# Altium project steve.PrjPcb (part 2 of 3)

## Sheet button_io.SchDoc
size A4
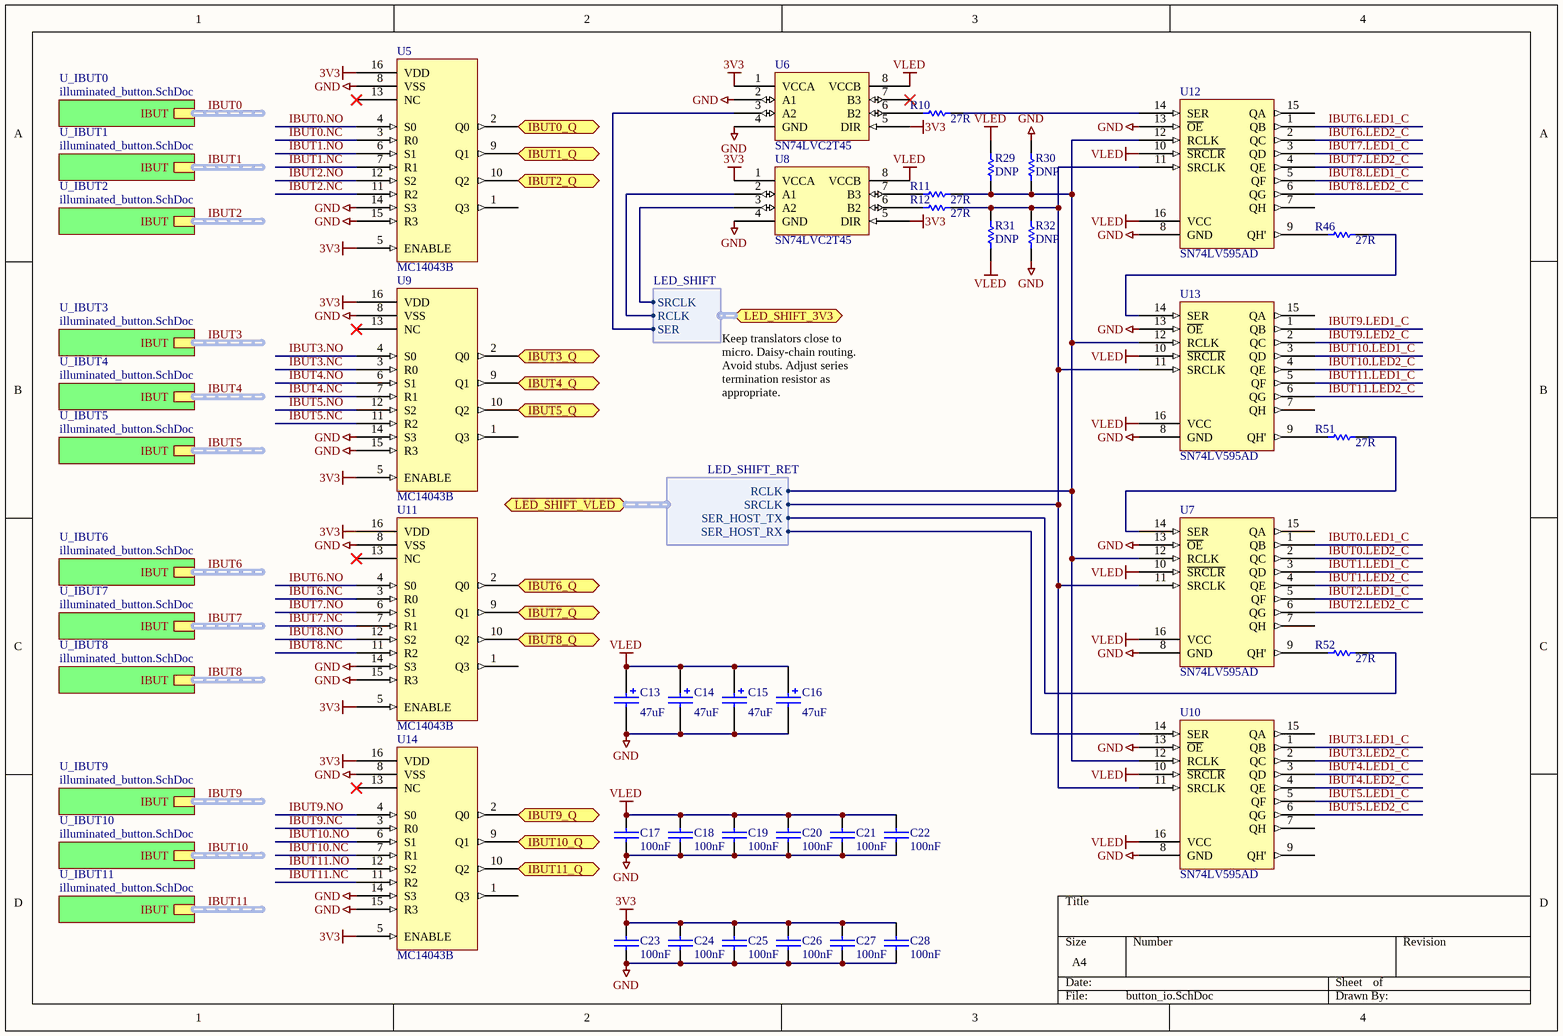
[diagram p6: button_io.SchDoc]

### Parts
C13  value 47uF  [CAPMP7343X19N (Murata D4)]
C14  value 47uF  [CAPMP7343X19N (Murata D4)]
C15  value 47uF  [CAPMP7343X19N (Murata D4)]
C16  value 47uF  [CAPMP7343X19N (Murata D4)]
C17  100nF  [0603]
C18  100nF  [0603]
C19  100nF  [0603]
C20  100nF  [0603]
C21  100nF  [0603]
C22  100nF  [0603]
C23  100nF  [0603]
C24  100nF  [0603]
C25  100nF  [0603]
C26  100nF  [0603]
C27  100nF  [0603]
C28  100nF  [0603]
R10  27R  [0603]
R11  27R  [0603]
R12  27R  [0603]
R29  DNP  [0603]
R30  DNP  [0603]
R31  DNP  [0603]
R32  DNP  [0603]
R46  27R  [0603]
R51  27R  [0603]
R52  27R  [0603]
U5  MC14043B  [SOIC127P600X175-16N]
U6  SN74LVC2T45  [TSOP65P400X130-8N]
U7  SN74LV595AD  [SOIC127P600X175-16N]
U8  SN74LVC2T45  [TSOP65P400X130-8N]
U9  MC14043B  [SOIC127P600X175-16N]
U10  SN74LV595AD  [SOIC127P600X175-16N]
U11  MC14043B  [SOIC127P600X175-16N]
U12  SN74LV595AD  [SOIC127P600X175-16N]
U13  SN74LV595AD  [SOIC127P600X175-16N]
U14  MC14043B  [SOIC127P600X175-16N]

### Sub-sheets
U_IBUT0 = illuminated_button.SchDoc: IBUT (harness IBUT)
U_IBUT1 = illuminated_button.SchDoc: IBUT (harness IBUT)
U_IBUT2 = illuminated_button.SchDoc: IBUT (harness IBUT)
U_IBUT3 = illuminated_button.SchDoc: IBUT (harness IBUT)
U_IBUT4 = illuminated_button.SchDoc: IBUT (harness IBUT)
U_IBUT5 = illuminated_button.SchDoc: IBUT (harness IBUT)
U_IBUT6 = illuminated_button.SchDoc: IBUT (harness IBUT)
U_IBUT7 = illuminated_button.SchDoc: IBUT (harness IBUT)
U_IBUT8 = illuminated_button.SchDoc: IBUT (harness IBUT)
U_IBUT9 = illuminated_button.SchDoc: IBUT (harness IBUT)
U_IBUT10 = illuminated_button.SchDoc: IBUT (harness IBUT)
U_IBUT11 = illuminated_button.SchDoc: IBUT (harness IBUT)

### Ports
IBUT0_Q (out), IBUT1_Q (out), IBUT2_Q (out), IBUT3_Q (out), IBUT4_Q (out), IBUT5_Q (out), IBUT6_Q (out), IBUT7_Q (out), IBUT8_Q (out), IBUT9_Q (out), IBUT10_Q (out), IBUT11_Q (out), LED_SHIFT_3V3 (harness LED_SHIFT), LED_SHIFT_VLED (harness LED_SHIFT_RET)

### Harnesses
LED_SHIFT: SER, RCLK, SRCLK
LED_SHIFT_RET: SER_HOST_TX, RCLK, SRCLK, SER_HOST_RX

### Nets
3V3: C23.1 C24.1 C25.1 C26.1 C27.1 C28.1 U5.5(ENABLE) U5.16(VDD) U6.1(VCCA) U6.5(DIR) U8.1(VCCA) U8.5(DIR) U9.5(ENABLE) U9.16(VDD) U11.5(ENABLE) U11.16(VDD) U14.5(ENABLE) U14.16(VDD)
GND: C13.2 C14.2 C15.2 C16.2 C17.2 C18.2 C19.2 C20.2 C21.2 C22.2 C23.2 C24.2 C25.2 C26.2 C27.2 C28.2 R30.1 R32.2 U5.8(VSS) U5.14(S3) U5.15(R3) U6.2(A1) U6.4(GND) U7.8(GND) U7.13(~{OE}) U8.4(GND) U9.8(VSS) U9.14(S3) U9.15(R3) U10.8(GND) U10.13(~{OE}) U11.8(VSS) U11.14(S3) U11.15(R3) U12.8(GND) U12.13(~{OE}) U13.8(GND) U13.13(~{OE}) U14.8(VSS) U14.14(S3) U14.15(R3)
VLED: C13.1 C14.1 C15.1 C16.1 C17.1 C18.1 C19.1 C20.1 C21.1 C22.1 R29.1 R31.2 U6.8(VCCB) U7.10(~{SRCLR}) U7.16(VCC) U8.8(VCCB) U10.10(~{SRCLR}) U10.16(VCC) U12.10(~{SRCLR}) U12.16(VCC) U13.10(~{SRCLR}) U13.16(VCC)
IBUT0.LED1_C: U7.1(QB)
IBUT0.LED2_C: U7.2(QC)
IBUT0.NC: U5.3(R0)
IBUT0.NO: U5.4(S0)
IBUT1.LED1_C: U7.3(QD)
IBUT1.LED2_C: U7.4(QE)
IBUT1.NC: U5.7(R1)
IBUT1.NO: U5.6(S1)
IBUT2.LED1_C: U7.5(QF)
IBUT2.LED2_C: U7.6(QG)
IBUT2.NC: U5.11(R2)
IBUT2.NO: U5.12(S2)
IBUT3.LED1_C: U10.1(QB)
IBUT3.LED2_C: U10.2(QC)
IBUT3.NC: U9.3(R0)
IBUT3.NO: U9.4(S0)
IBUT4.LED1_C: U10.3(QD)
IBUT4.LED2_C: U10.4(QE)
IBUT4.NC: U9.7(R1)
IBUT4.NO: U9.6(S1)
IBUT5.LED1_C: U10.5(QF)
IBUT5.LED2_C: U10.6(QG)
IBUT5.NC: U9.11(R2)
IBUT5.NO: U9.12(S2)
IBUT6.LED1_C: U12.1(QB)
IBUT6.LED2_C: U12.2(QC)
IBUT6.NC: U11.3(R0)
IBUT6.NO: U11.4(S0)
IBUT7.LED1_C: U12.3(QD)
IBUT7.LED2_C: U12.4(QE)
IBUT7.NC: U11.7(R1)
IBUT7.NO: U11.6(S1)
IBUT8.LED1_C: U12.5(QF)
IBUT8.LED2_C: U12.6(QG)
IBUT8.NC: U11.11(R2)
IBUT8.NO: U11.12(S2)
IBUT9.LED1_C: U13.1(QB)
IBUT9.LED2_C: U13.2(QC)
IBUT9.NC: U14.3(R0)
IBUT9.NO: U14.4(S0)
IBUT10.LED1_C: U13.3(QD)
IBUT10.LED2_C: U13.4(QE)
IBUT10.NC: U14.7(R1)
IBUT10.NO: U14.6(S1)
IBUT11.LED1_C: U13.5(QF)
IBUT11.LED2_C: U13.6(QG)
IBUT11.NC: U14.11(R2)
IBUT11.NO: U14.12(S2)
PIO 0.2/SSEL0: U8.2(A1) ; port LED_SHIFT_3V3.RCLK
PIO 0.6: U14.2(Q0) ; port IBUT9_Q
PIO 0.7: U14.10(Q2) ; port IBUT11_Q
PIO 0.8/MISO0: U14.9(Q1) ; port IBUT10_Q
PIO 0.9/MOSI0: U6.3(A2) ; port LED_SHIFT_3V3.SER
PIO 0.10/SCK0: U8.3(A2) ; port LED_SHIFT_3V3.SRCLK
PIO 1.5: U9.2(Q0) ; port IBUT3_Q
PIO 1.8: U9.9(Q1) ; port IBUT4_Q
PIO 1.9: U9.10(Q2) ; port IBUT5_Q
PIO 1.11/ADC7: U11.2(Q0) ; port IBUT6_Q
PIO 2.5: U11.9(Q1) ; port IBUT7_Q
PIO 2.6: U5.2(Q0) ; port IBUT0_Q
PIO 2.7: U5.9(Q1) ; port IBUT1_Q
PIO 2.8: U5.10(Q2) ; port IBUT2_Q
PIO 2.10: U11.10(Q2) ; port IBUT8_Q
NetR10_1: R10.1 U12.14(SER)
NetR10_2: R10.2 U6.6(B2)
NetR11_1: R11.1 R29.2 R30.2 U7.12(RCLK) U10.12(RCLK) U12.12(RCLK) U13.12(RCLK) ; port LED_SHIFT_VLED.RCLK
NetR11_2: R11.2 U8.7(B3)
NetR12_1: R12.1 R31.1 R32.1 U7.11(SRCLK) U10.11(SRCLK) U12.11(SRCLK) U13.11(SRCLK) ; port LED_SHIFT_VLED.SRCLK
NetR12_2: R12.2 U8.6(B2)
NetR46_1: R46.1 U13.14(SER)
NetR46_2: R46.2 U12.9(QH')
NetR51_1: R51.1 U7.14(SER)
NetR51_2: R51.2 U13.9(QH')
NetR52_1: R52.1 ; port LED_SHIFT_VLED.SER_HOST_TX
NetR52_2: R52.2 U7.9(QH')
NetR53_1: U10.14(SER) ; port LED_SHIFT_VLED.SER_HOST_RX

Not connected (* = marked no-connect by the designer): U5 1(Q3) 13(NC)*; U6 7(B3)*; U7 7(QH) 15(QA); U9 1(Q3) 13(NC)*; U10 7(QH) 9(QH') 15(QA); U11 1(Q3) 13(NC)*; U12 7(QH) 15(QA); U13 7(QH) 15(QA); U14 1(Q3) 13(NC)*

### Buses and harness runs
harness IBUT0 = sheet U_IBUT0/IBUT
harness IBUT1 = sheet U_IBUT1/IBUT
harness IBUT2 = sheet U_IBUT2/IBUT
harness IBUT3 = sheet U_IBUT3/IBUT
harness IBUT4 = sheet U_IBUT4/IBUT
harness IBUT5 = sheet U_IBUT5/IBUT
harness IBUT6 = sheet U_IBUT6/IBUT
harness IBUT7 = sheet U_IBUT7/IBUT
harness IBUT8 = sheet U_IBUT8/IBUT
harness IBUT9 = sheet U_IBUT9/IBUT
harness IBUT10 = sheet U_IBUT10/IBUT
harness IBUT11 = sheet U_IBUT11/IBUT

### Notes on the sheet
- Keep translators close to micro. Daisy-chain routing. Avoid stubs. Adjust series termination resistor as appropriate.
- (near C18) Text
- (near C24) Text

### Library data of the parts
C13-C16 = CAP POL3: Polarized Capacitor (Surface Mount); Manufacturer: Generic Components; Manufacturer Part Number: ECASD40J476M025K00; Class I: Passive; Description: CAP ALUM 47UF 6.3V 20% SMD; Capacitance: 47µF; Voltage Rating: 6.3V; Tolerance: ±20%; ESR (Equivalent Series Resistance): 25 mOhm; Lifetime @ Temp.: 1000 Hrs @ 105°C; Type: Polymer; Ripple Current: 1.8A; Surface Mount Land Size: 0.287" L x 0.169" W (7.30mm x 4.30mm); Published: 8-Jun-2000; Revision: July-2002: Re-released for DXP Platform.; Publisher: Altium Limited; Class II: Capacitor; Digikey: 490-5463-1-ND; Supplier 1: Digi-Key; Supplier Part Number 1: 490-5463-1-ND; RoHS: RoHS Compliant; Category: Capacitors; Stock 1: 3903; Pricing 1: 1=2.26, 10=1.848, 50=1.6224, 100=1.307, 250=1.0816, 500=0.96896, 1000=0.85628 (AUD); Packaging: Cut Tape (CT); Operating Temperature: -40°C ~ 105°C; Applications: -; Impedance: -; Lead Spacing: -; Size / Dimension: 0.287" L x 0.169" W (7.30mm x 4.30mm); Height - Seated (Max): 0.075" (1.90mm); Mounting Type: Surface Mount; Package / Case: 2917 (7343 Metric); ComponentLink1URL: http://www.murata.com/products/catalog/pdf/c90e.pdf; ComponentLink1Description: http://www.murata.com/products/catalog/pdf/c90e.pdf
C17-C28 = CAP: Capacitor; Manufacturer: TDK Corporation; Manufacturer Part Number: C1608X7R1H103K080AA; Needed?: NO - HW LAB; Description: CAP CER 10000PF 50V 10% X7R 0603; Capacitance: 10000pF; Voltage - Rated: 50V; Tolerance: ±10%; Temperature Coefficient: X7R; Value: 100nF; Supplier 1: Digi-Key; Supplier Part Number 1: 445-1311-1-ND; RoHS: RoHS Compliant; Category: Capacitors; Stock 1: 569844; Pricing 1: 1=0.14, 10=0.035, 100=0.0159, 250=0.01296, 500=0.0111, 1000=0.00865 (AUD); Packaging: Cut Tape (CT); Mounting Type: Surface Mount, MLCC; Operating Temperature: -55°C ~ 125°C; Applications: General Purpose; Ratings: -; Package / Case: 0603 (1608 Metric); Size / Dimension: 0.063" L x 0.031" W (1.60mm x 0.80mm); Height - Seated (Max): -; Thickness (Max): 0.037" (0.95mm); Lead Spacing: -; Features: -; Lead Style: -; ComponentLink1URL: http://product.tdk.com/capacitor/mlcc/en/documents/mlcc_commercial_general_en.pdf; ComponentLink1Description: http://product.tdk.com/capacitor/mlcc/en/documents/mlcc_commercial_general_en.pdf
R10-R12 R46 R51 R52 = Res Semi: Semiconductor Resistor; Manufacturer: Panasonic Electronic Components; Manufacturer Part Number: ERJ-3EKF27R0V; Value: 1K; Description: RES 27 OHM 1/10W 1% 0603 SMD; Resistance (Ohms): 27; Power (Watts): 0.1W, 1/10W; Temperature Coefficient: ±100ppm/°C; Tolerance: ±1%; Published: 8-Jun-2000; LatestRevisionDate: 17-Jul-2002; LatestRevisionNote: Re-released for DXP Platform.; PackageReference: AXIAL-0.5; Publisher: Altium Limited; PackageDescription: Axial Device, Thru-Hole; 2 Leads; 0.5 in Pin Spacing; Supplier 1: Digi-Key; Supplier Part Number 1: P27.0HCT-ND; RoHS: RoHS Compliant; Category: Resistors; Stock 1: 89523; Pricing 1: 1=0.12, 50=0.0166, 100=0.0126, 250=0.00936, 500=0.00692, 1000=0.00461 (AUD); Packaging: Cut Tape (CT); Composition: Thick Film; Features: -; Package / Case: 0603 (1608 Metric); Supplier Device Package: 0603; Size / Dimension: 0.063" L x 0.031" W (1.60mm x 0.80mm); Height: 0.022" (0.55mm); Number of Terminations: 2; ComponentLink1URL: http://industrial.panasonic.com/www-cgi/jvcr13pz.cgi?E+PZ+3+AOA0002+ERJ3EKF27R0V+7+WW; ComponentLink1Description: http://industrial.panasonic.com/www-cgi/jvcr13pz.cgi?E+PZ+3+AOA0002+ERJ3EKF27R0V+7+WW
R29-R32 = Res Semi: Semiconductor Resistor; Value: 1K; Published: 8-Jun-2000; LatestRevisionDate: 17-Jul-2002; LatestRevisionNote: Re-released for DXP Platform.; PackageReference: AXIAL-0.5; Publisher: Altium Limited; PackageDescription: Axial Device, Thru-Hole; 2 Leads; 0.5 in Pin Spacing
U5 U9 U11 U14 = MC14043B: Quad CMOS R-S Latches; Part Number: MC14043BDR2G; Manufacturer: ON Semiconductor; Description: IC LATCH R-S QUAD P/N 16-SOIC; Logic Type: S-R Latch; Circuit: 1:1; Output Type: Tri-State; Voltage - Supply: 3 V ~ 18 V; Independent Circuits: 4; Delay Time - Propagation: 60ns; Current - Output High, Low: 8.8mA, 8.8mA; Supplier 1: Digi-Key; Supplier Part Number 1: MC14043BDR2GOSCT-ND; Manufacturer Part Number: MC14043BDR2G; RoHS: RoHS Compliant; Category: Integrated Circuits (ICs); Stock 1: 3794; Pricing 1: 1=0.67, 10=0.57, 25=0.4988, 100=0.4271, 250=0.3704, 500=0.31374, 1000=0.24186 (AUD); Packaging: Cut Tape (CT); Operating Temperature: -55°C ~ 125°C; Mounting Type: Surface Mount; Package / Case: 16-SOIC (0.154", 3.90mm Width); Supplier Device Package: 16-SOIC; ComponentLink1URL: http://www.onsemi.com/pub_link/Collateral/MC14043B-D.PDF; ComponentLink1Description: http://www.onsemi.com/pub_link/Collateral/MC14043B-D.PDF
U6 U8 = SN74LVC2T45: Dual-bit  Dual-supply Bus Transceiver; Part Number: SN74LVC2T45DCT; Manufacturer: Texas Instruments; Manufacturer Part Number: SN74LVC2T45DCTR; Description: IC BUS TRANSCVR 2BIT N-INV SM8; Logic Function: Translator, Bidirectional, 3-State; Number of Bits: 2; Input Type: Logic; Data Rate: 420Mbps; Number of Outputs/Channel: 1; Differential - Input:Output: No/No; Propagation Delay (Max): 3.5ns; Voltage - Supply: 1.65 V ~ 5.5 V; Supplier 1: Digi-Key; Supplier Part Number 1: 296-16845-1-ND; RoHS: RoHS Compliant; Category: Integrated Circuits (ICs); Stock 1: 23612; Pricing 1: 1=0.89, 10=0.781, 25=0.6904, 100=0.6014, 250=0.52352, 500=0.44562, 1000=0.35693 (AUD); Packaging: Cut Tape (CT); Output Type: Logic; Number of Channels: 2; Operating Temperature: -40°C ~ 85°C; Package / Case: 8-LSSOP (0.11", 2.80mm Width); Supplier Device Package: SM8; ComponentLink1URL: http://www.ti.com/lit/ds/symlink/sn74lvc2t45.pdf; ComponentLink1Description: http://www.ti.com/lit/ds/symlink/sn74lvc2t45.pdf
U7 U10 U12 U13 = SN74LV595AD: 8-Bit Shift Registers with 3-State Output Registers; Manufacturer: Texas Instruments; Manufacturer Part Number: SN74LV595ADR; Description: IC 8-BIT SHFT REG TRI-ST 16-SOIC; Output Type: Tri-State; Number of Elements: 1; Number of Bits per Element: 8; Function: Serial to Parallel, Serial; Voltage - Supply: 2 V ~ 5.5 V; Supplier 1: Digi-Key; Supplier Part Number 1: 296-18747-1-ND; RoHS: RoHS Compliant; Category: Integrated Circuits (ICs); Stock 1: 11778; Pricing 1: 1=1.19, 10=1.041, 25=0.92, 100=0.8018, 250=0.698, 500=0.59416, 1000=0.47591 (AUD); Packaging: Cut Tape (CT); Logic Type: Shift Register; Operating Temperature: -40°C ~ 85°C; Mounting Type: Surface Mount; Package / Case: 16-SOIC (0.154", 3.90mm Width); Supplier Device Package: 16-SOIC N; ComponentLink1URL: http://www.ti.com/lit/ds/symlink/sn74lv595a.pdf; ComponentLink1Description: http://www.ti.com/lit/ds/symlink/sn74lv595a.pdf

## Sheet illuminated_button.SchDoc
size A4
Used 12 times, as channels U_button_io/U_IBUT0, U_button_io/U_IBUT1, U_button_io/U_IBUT2, U_button_io/U_IBUT3, U_button_io/U_IBUT4, U_button_io/U_IBUT5, U_button_io/U_IBUT6, U_button_io/U_IBUT7, U_button_io/U_IBUT8, U_button_io/U_IBUT9, U_button_io/U_IBUT10, U_button_io/U_IBUT11. Parts and nets are listed once, with the designators drawn on the sheet.
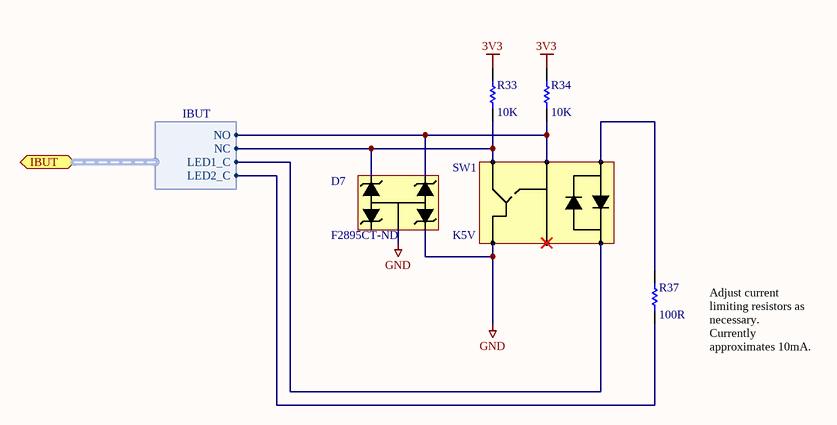
[diagram p7: illuminated_button.SchDoc]

### Parts
D7  Supplier Part Number 1: F2895CT-ND  [SC70-5]  (hidden comment: SP1001-04)
R33  value 10K  [0603]
R34  value 10K  [0603]
R37  value 100R  [0603]
SW1  K5V  [K5V_PM]

### Ports
IBUT (harness IBUT)

### Harnesses
IBUT: NC, NO, LED1_C, LED2_C

### Nets
3V3: R33.2 R34.2
GND: D7.2 D7.3 SW1.2
NetD7_4: D7.4 R34.1 SW1.3 ; port IBUT.NO
NetD7_5: D7.5 R33.1 SW1.1 ; port IBUT.NC
NetR37_1: R37.1 ; port IBUT.LED2_C
NetR37_2: R37.2 SW1.5
NetSW1_6: SW1.6 ; port IBUT.LED1_C

Not connected (* = marked no-connect by the designer): D7 1; SW1 4*

### Channels
U_button_io/U_IBUT0: designators end in _U_IBUT0
U_button_io/U_IBUT1: designators end in _U_IBUT1
U_button_io/U_IBUT2: designators end in _U_IBUT2
U_button_io/U_IBUT3: designators end in _U_IBUT3
U_button_io/U_IBUT4: designators end in _U_IBUT4
U_button_io/U_IBUT5: designators end in _U_IBUT5
U_button_io/U_IBUT6: designators end in _U_IBUT6
U_button_io/U_IBUT7: designators end in _U_IBUT7
U_button_io/U_IBUT8: designators end in _U_IBUT8
U_button_io/U_IBUT9: designators end in _U_IBUT9
U_button_io/U_IBUT10: designators end in _U_IBUT10
U_button_io/U_IBUT11: designators end in _U_IBUT11

### Notes on the sheet
- Adjust current limiting resistors as necessary.
  Currently approximates 10mA.

### Library data of the parts
D7 = SP1001-04: 8pF 15kV Unidirectional TVS Array 0.5uA@5.5V; Manufacturer: Littelfuse Inc; Manufacturer Part Number: SP1001-04JTG; Description: TVS ARRAY ESD SIL 4CH SC70-5; Voltage - Reverse Standoff (Typ): 5.5V; Voltage - Breakdown: 6V; Polarization: 4 Channel Array - Unidirectional; Supplier 1: Digi-Key; RoHS: RoHS Compliant; Category: Circuit Protection; Stock 1: 3207; Pricing 1: 1=0.71, 10=0.594, 25=0.5208, 100=0.4456, 250=0.38648, 500=0.32736, 1000=0.25238 (AUD); Packaging: Cut Tape (CT); Power (Watts): -; Mounting Type: Surface Mount; Package / Case: 6-TSSOP (5 Lead), SC-88A, SOT-353; Supplier Device Package: SC-70-5; ComponentLink1URL: http://www.littelfuse.com/~/media/Files/Littelfuse/Technical%20Resources/Documents/Data%20Sheets/Littelfuse_TVS_Diode_Array_SP1001_Datasheet.pdf; ComponentLink1Description: http://www.littelfuse.com/~/media/Files/Littelfuse/Technical%20Resources/Documents/Data%20Sheets/Littelfuse_TVS_Diode_Array_SP1001_Datasheet.pdf
R33 R34 = Res Semi: Semiconductor Resistor; Manufacturer: TE Connectivity; Manufacturer Part Number: 1622829-1; Description: RES 10.0K OHM 1/10W 1% 0603; Power (Watts): 0.1W, 1/10W; Temperature Coefficient: ±100ppm/°C; Tolerance: ±1%; Published: 8-Jun-2000; LatestRevisionDate: 17-Jul-2002; LatestRevisionNote: Re-released for DXP Platform.; PackageReference: AXIAL-0.5; Publisher: Altium Limited; PackageDescription: Axial Device, Thru-Hole; 2 Leads; 0.5 in Pin Spacing; Supplier 1: Digi-Key; Supplier Part Number 1: A106048CT-ND; RoHS: RoHS Compliant; Category: Resistors; Stock 1: 36711; Pricing 1: 1=0.12, 10=0.02, 25=0.0148, 50=0.0116, 100=0.0085, 250=0.00648, 500=0.0052, 1000=0.00382, 2500=0.00331 (AUD); Packaging: Cut Tape (CT); Resistance (Ohms): 10k; Composition: Thick Film; Features: -; Package / Case: 0603 (1608 Metric); Supplier Device Package: 0603; Size / Dimension: 0.063" L x 0.031" W (1.60mm x 0.80mm); Height: 0.022" (0.55mm); Number of Terminations: 2; ComponentLink1URL: http://www.te.com/commerce/DocumentDelivery/DDEController?Action=srchrtrv&DocNm=1622829&DocType=Customer+Drawing&DocLang=English; ComponentLink1Description: http://www.te.com/commerce/DocumentDelivery/DDEController?Action=srchrtrv&DocNm=1622829&DocType=Customer+Drawing&DocLang=English
R37 = Res Semi: Semiconductor Resistor; Manufacturer: Panasonic Electronic Components; Manufacturer Part Number: ERJ-3EKF1000V; Description: RES 100 OHM 1/10W 1% 0603 SMD; Resistance (Ohms): 100; Power (Watts): 0.1W, 1/10W; Temperature Coefficient: ±100ppm/°C; Tolerance: ±1%; Published: 8-Jun-2000; LatestRevisionDate: 17-Jul-2002; LatestRevisionNote: Re-released for DXP Platform.; PackageReference: AXIAL-0.5; Publisher: Altium Limited; PackageDescription: Axial Device, Thru-Hole; 2 Leads; 0.5 in Pin Spacing; Supplier 1: Digi-Key; Supplier Part Number 1: P100HCT-ND; RoHS: RoHS Compliant; Category: Resistors; Stock 1: 1636355; Pricing 1: 1=0.12, 50=0.0166, 100=0.0126, 250=0.00936, 500=0.00692, 1000=0.00461 (AUD); Packaging: Cut Tape (CT); Composition: Thick Film; Features: -; Package / Case: 0603 (1608 Metric); Supplier Device Package: 0603; Size / Dimension: 0.063" L x 0.031" W (1.60mm x 0.80mm); Height: 0.022" (0.55mm); Number of Terminations: 2; ComponentLink1URL: http://industrial.panasonic.com/www-cgi/jvcr13pz.cgi?E+PZ+3+AOA0002+ERJ3EKF1000V+7+WW; ComponentLink1Description: http://industrial.panasonic.com/www-cgi/jvcr13pz.cgi?E+PZ+3+AOA0002+ERJ3EKF1000V+7+WW
SW1 = K5V: K5V Illuminated Tactile Switch

## Sheet alphanumeric.SchDoc
size A4
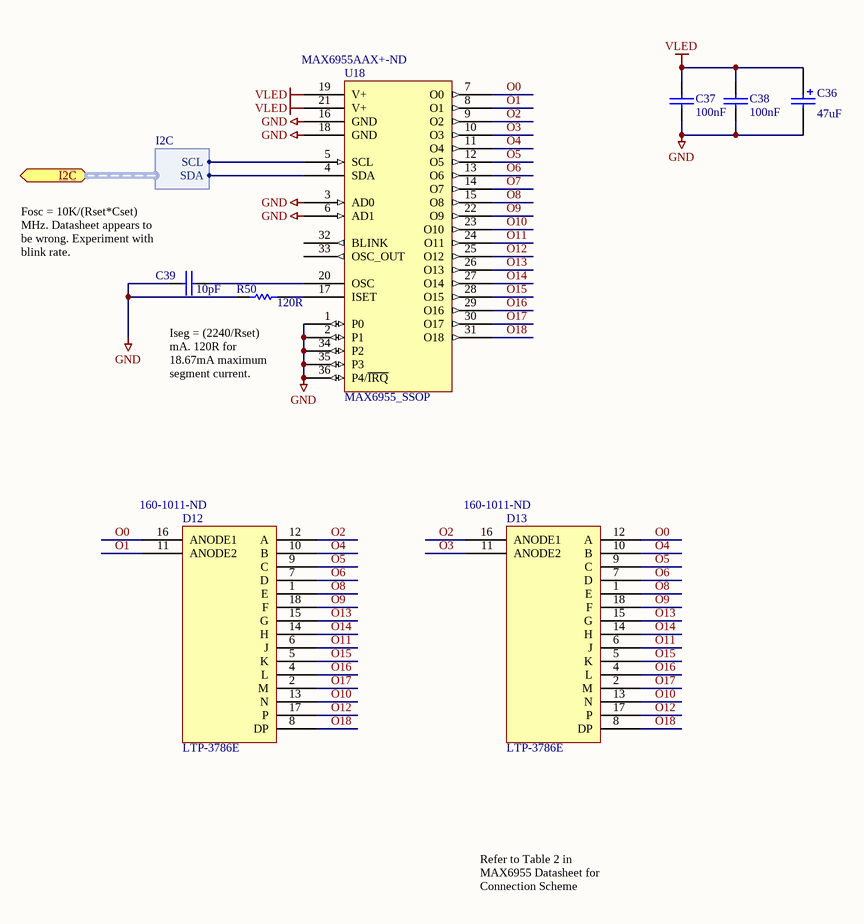
[diagram p8: alphanumeric.SchDoc]

### Parts
C36  value 47uF  [CAPMP7343X19N (Murata D4)]
C37  100nF  [0603]
C38  100nF  [0603]
C39  10pF  [0603]
D12  LTP-3786E  Supplier Part Number 1: 160-1011-ND  [LTP-3786E]
D13  LTP-3786E  Supplier Part Number 1: 160-1011-ND  [LTP-3786E]
R50  120R  [0603]
U18  MAX6955_SSOP  Supplier Part Number 1: MAX6955AAX+-ND  [SOP127P600-8N-36]

### Ports
I2C (harness I2C)

### Harnesses
I2C: SCL, SDA

### Nets
GND: C36.2 C37.1 C38.2 C39.1 R50.2 U18.1(P0) U18.2(P1) U18.3(AD0) U18.6(AD1) U18.16(GND) U18.18(GND) U18.34(P2) U18.35(P3) U18.36(P4/~{IRQ})
VLED: C36.1 C37.2 C38.1 U18.19(V+) U18.21(V+)
O0: D12.16(ANODE1) D13.12(A) U18.7(O0)
O1: D12.11(ANODE2) U18.8(O1)
O2: D12.12(A) D13.16(ANODE1) U18.9(O2)
O3: D13.11(ANODE2) U18.10(O3)
O4: D12.10(B) D13.10(B) U18.11(O4)
O5: D12.9(C) D13.9(C) U18.12(O5)
O6: D12.7(D) D13.7(D) U18.13(O6)
O7: U18.14(O7)
O8: D12.1(E) D13.1(E) U18.15(O8)
O9: D12.18(F) D13.18(F) U18.22(O9)
O10: D12.13(N) D13.13(N) U18.23(O10)
O11: D12.6(J) D13.6(J) U18.24(O11)
O12: D12.17(P) D13.17(P) U18.25(O12)
O13: D12.15(G) D13.15(G) U18.26(O13)
O14: D12.14(H) D13.14(H) U18.27(O14)
O15: D12.5(K) D13.5(K) U18.28(O15)
O16: D12.4(L) D13.4(L) U18.29(O16)
O17: D12.2(M) D13.2(M) U18.30(O17)
O18: D12.8(DP) D13.8(DP) U18.31(O18)
PIO 0.4/SCL: U18.5(SCL) ; port I2C.SCL
PIO 0.5/SDA: U18.4(SDA) ; port I2C.SDA
NetC39_2: C39.2 U18.20(OSC)
NetR50_1: R50.1 U18.17(ISET)

Not connected (* = marked no-connect by the designer): U18 32(BLINK) 33(OSC_OUT)

### Notes on the sheet
- (near C39) Fosc = 10K/(Rset*Cset) MHz. Datasheet appears to be wrong. Experiment with blink rate.
- Iseg = (2240/Rset) mA. 120R for 18.67mA maximum segment current.
- Refer to Table 2 in MAX6955 Datasheet for Connection Scheme

### Library data of the parts
C36 = CAP POL3: as C13 on sheet button_io; Published: 8-Jun-2000; Revision: July-2002: Re-released for DXP Platform.; Publisher: Altium Limited; Class II: Capacitor; Digikey: 490-5463-1-ND; Supplier 1: Digi-Key; Supplier Part Number 1: 490-5463-1-ND; RoHS: RoHS Compliant; Category: Capacitors; Stock 1: 3903; Pricing 1: 1=2.26, 10=1.848, 50=1.6224, 100=1.307, 250=1.0816, 500=0.96896, 1000=0.85628 (AUD); Packaging: Cut Tape (CT); Operating Temperature: -40°C ~ 105°C; Applications: -; Impedance: -; Lead Spacing: -; Size / Dimension: 0.287" L x 0.169" W (7.30mm x 4.30mm); Height - Seated (Max): 0.075" (1.90mm); Mounting Type: Surface Mount; Package / Case: 2917 (7343 Metric); ComponentLink1URL: http://www.murata.com/products/catalog/pdf/c90e.pdf; ComponentLink1Description: http://www.murata.com/products/catalog/pdf/c90e.pdf
C37 C38 = CAP: as C17 on sheet button_io; Value: 100nF; Supplier 1: Digi-Key; Supplier Part Number 1: 445-1311-1-ND; RoHS: RoHS Compliant; Category: Capacitors; Stock 1: 569984; Pricing 1: 1=0.14, 10=0.035, 100=0.0159, 250=0.01296, 500=0.0111, 1000=0.00865 (AUD); Packaging: Cut Tape (CT); Mounting Type: Surface Mount, MLCC; Operating Temperature: -55°C ~ 125°C; Applications: General Purpose; Ratings: -; Package / Case: 0603 (1608 Metric); Size / Dimension: 0.063" L x 0.031" W (1.60mm x 0.80mm); Height - Seated (Max): -; Thickness (Max): 0.037" (0.95mm); Lead Spacing: -; Features: -; Lead Style: -; ComponentLink1URL: http://product.tdk.com/capacitor/mlcc/en/documents/mlcc_commercial_general_en.pdf; ComponentLink1Description: http://product.tdk.com/capacitor/mlcc/en/documents/mlcc_commercial_general_en.pdf
C39 = CAP: Capacitor; Manufacturer: TDK Corporation; Manufacturer Part Number: C1608C0G1H100D080AA; Needed?: NO - HW LAB; Description: CAP CER 10PF 50V NP0 0603; Voltage - Rated: 50V; Tolerance: ±0.5pF; Temperature Coefficient: C0G, NP0; Value: 10pF; Supplier 1: Digi-Key; Supplier Part Number 1: 445-1269-1-ND; RoHS: RoHS Compliant; Category: Capacitors; Stock 1: 206915; Pricing 1: 1=0.12, 10=0.043, 100=0.0198, 250=0.01624, 500=0.0139, 1000=0.01082 (AUD); Packaging: Cut Tape (CT); Capacitance: 10pF; Mounting Type: Surface Mount, MLCC; Operating Temperature: -55°C ~ 125°C; Applications: General Purpose; Ratings: -; Package / Case: 0603 (1608 Metric); Size / Dimension: 0.063" L x 0.031" W (1.60mm x 0.80mm); Height - Seated (Max): -; Thickness (Max): 0.037" (0.95mm); Lead Spacing: -; Features: -; Lead Style: -; ComponentLink1URL: http://product.tdk.com/capacitor/mlcc/en/documents/mlcc_commercial_general_en.pdf; ComponentLink1Description: http://product.tdk.com/capacitor/mlcc/en/documents/mlcc_commercial_general_en.pdf
D12 D13 = LTP-3786E: 13.8mm dual digit 14-segment single digit alphanumeric display; Manufacturer: Lite-On Inc; Description: LED ALPHNUM.54" 2DGT RED-ORNG CA; Number of Digits/Alpha: 2; Digit/Alpha Size: 0.54" (13.80mm); Display Type: 14-Segment, Alphanumeric; Common Pin: Common Anode; Color: Orange-Red; Voltage - Forward (Vf) Typ: 2V; Current - Test: 20mA; Millicandela Rating: 2.3mcd; Wavelength - Peak: 630nm; Power Dissipation (Max): 75mW; Supplier 1: Digi-Key; Manufacturer Part Number: LTP-3786E; RoHS: RoHS Compliant; Category: Optoelectronics; Stock 1: 1999; Pricing 1: 1=4.1, 10=3.413, 100=2.457, 250=2.184, 500=1.97926, 1000=1.82 (AUD); Size / Dimension: 0.833" H x 0.992" W x 0.307" D (21.15mm x 25.20mm x 7.80mm); Package / Case: 18-DIP; ComponentLink1URL: http://media.digikey.com/pdf/Data%20Sheets/Lite-On%20PDFs/LTP-3786E.pdf; ComponentLink1Description: http://media.digikey.com/pdf/Data%20Sheets/Lite-On%20PDFs/LTP-3786E.pdf
R50 = Res Semi: Semiconductor Resistor; Manufacturer: Panasonic Electronic Components; Manufacturer Part Number: ERJ-3EKF1200V; Value: 1K; Description: RES 120 OHM 1/10W 1% 0603 SMD; Resistance (Ohms): 120; Power (Watts): 0.1W, 1/10W; Temperature Coefficient: ±100ppm/°C; Tolerance: ±1%; Published: 8-Jun-2000; LatestRevisionDate: 17-Jul-2002; LatestRevisionNote: Re-released for DXP Platform.; PackageReference: AXIAL-0.5; Publisher: Altium Limited; PackageDescription: Axial Device, Thru-Hole; 2 Leads; 0.5 in Pin Spacing; Supplier 1: Digi-Key; Supplier Part Number 1: P120HCT-ND; RoHS: RoHS Compliant; Category: Resistors; Stock 1: 359464; Pricing 1: 1=0.12, 50=0.0166, 100=0.0126, 250=0.00936, 500=0.00692, 1000=0.00461 (AUD); Packaging: Cut Tape (CT); Composition: Thick Film; Features: -; Package / Case: 0603 (1608 Metric); Supplier Device Package: 0603; Size / Dimension: 0.063" L x 0.031" W (1.60mm x 0.80mm); Height: 0.022" (0.55mm); Number of Terminations: 2; ComponentLink1URL: http://industrial.panasonic.com/www-cgi/jvcr13pz.cgi?E+PZ+3+AOA0002+ERJ3EKF1200V+7+WW; ComponentLink1Description: http://industrial.panasonic.com/www-cgi/jvcr13pz.cgi?E+PZ+3+AOA0002+ERJ3EKF1200V+7+WW
U18 = MAX6955_SSOP: 2-Wire Interfaced, 2.7V to 5.5V LED Display Driver; Manufacturer: Maxim Integrated; Manufacturer Part Number: MAX6955AAX+; Description: IC DRIVER LED SEG 14/16 36-SSOP; Configuration: 7, 14, 16 Segment; Interface: I²C; Current - Supply: 22mA; Voltage - Supply: 2.7 V ~ 5.5 V; Supplier 1: Digi-Key; RoHS: RoHS Compliant; Category: Integrated Circuits (ICs); Stock 1: 500; Pricing 1: 1=27.92, 25=19.5888, 100=14.1951, 500=12.48788 (AUD); Packaging: Tube; Display Type: LED; Digits or Characters: -; Operating Temperature: -40°C ~ 125°C; Mounting Type: Surface Mount; Package / Case: 36-BSOP (0.295", 7.50mm Width); Supplier Device Package: 36-SSOP; ComponentLink1URL: http://datasheets.maximintegrated.com/en/ds/MAX6955.pdf; ComponentLink1Description: http://datasheets.maximintegrated.com/en/ds/MAX6955.pdf

## Sheet paddles.SchDoc
size A4
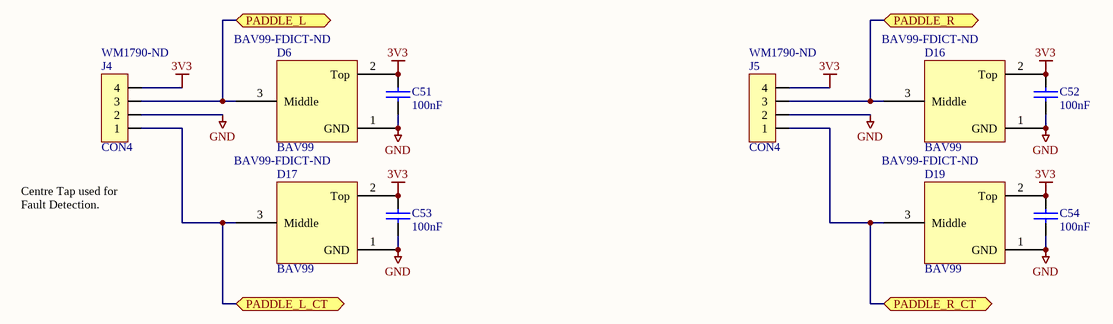
[diagram p9: paddles.SchDoc]

### Parts
C51  100nF  [0603]
C52  100nF  [0603]
C53  100nF  [0603]
C54  100nF  [0603]
D6  BAV99  Supplier Part Number 1: BAV99-FDICT-ND  [SOT23-3]
D16  BAV99  Supplier Part Number 1: BAV99-FDICT-ND  [SOT23-3]
D17  BAV99  Supplier Part Number 1: BAV99-FDICT-ND  [SOT23-3]
D19  BAV99  Supplier Part Number 1: BAV99-FDICT-ND  [SOT23-3]
J4  CON4  Supplier Part Number 1: WM1790-ND  [MICROFIT-4-VERT]
J5  CON4  Supplier Part Number 1: WM1790-ND  [MICROFIT-4-VERT]

### Ports
PADDLE_L, PADDLE_L_CT, PADDLE_R, PADDLE_R_CT

### Nets
3V3: C51.1 C52.1 C53.1 C54.1 D6.2(Top) D16.2(Top) D17.2(Top) D19.2(Top) J4.4 J5.4
GND: C51.2 C52.2 C53.2 C54.2 D6.1(GND) D16.1(GND) D17.1(GND) D19.1(GND) J4.2 J5.2
PIO 0.11/ADC0: D6.3(Middle) J4.3 ; port PADDLE_L
PIO 1.0/ADC1: D17.3(Middle) J4.1 ; port PADDLE_L_CT
PIO 1.1/ADC2: D16.3(Middle) J5.3 ; port PADDLE_R
PIO 1.2/ADC3: D19.3(Middle) J5.1 ; port PADDLE_R_CT

### Notes on the sheet
- Centre Tap used for Fault Detection.

### Library data of the parts
C51-C54 = CAP: Capacitor; Farnell: 753-567; Price: 0.31
D6 D16 D17 D19 = BAV99: Dual Diode; Manufacturer: Diodes Inc; Manufacturer Part Number: BAV99-7-F; Description: DIODE ARRAY 75V 300MA SOT23; Voltage - Forward (Vf) (Max) @ If: 1.25V @ 150mA; Current - Reverse Leakage @ Vr: 2.5µA @ 75V; Current - Average Rectified (Io) (per Diode): 300mA (DC); Voltage - DC Reverse (Vr) (Max): 75V; Reverse Recovery Time (trr): 4ns; Diode Type: Standard; Speed: Fast Recovery =< 500ns, > 200mA (Io); Diode Configuration: 1 Pair Series Connection; Supplier 1: Digi-Key; RoHS: RoHS Compliant; Category: Discrete Semiconductor Products; Stock 1: 234004; Pricing 1: 1=0.18, 10=0.171, 25=0.1548, 100=0.1114, 250=0.0656, 500=0.05444, 1000=0.03714 (AUD); Packaging: Cut Tape (CT); Mounting Type: Surface Mount; Package / Case: TO-236-3, SC-59, SOT-23-3; Supplier Device Package: SOT-23-3; ComponentLink1URL: http://www.diodes.com/datasheets/ds12007.pdf; ComponentLink1Description: http://www.diodes.com/datasheets/ds12007.pdf
J4 J5 = CON4: Connector; Manufacturer: Molex Inc; Manufacturer Part Number: 0430450412; Description: CONN HEADER 4POS 3MM VERT TIN; Connector Type: Header, Shrouded; Number of Positions: 4; Number of Positions Loaded: All; Pitch: 0.118" (3.00mm); element14: http://au.element14.com/molex/43045-0412/header-vertical-4way/dp/1012247; Supplier 1: Digi-Key; RoHS: RoHS Compliant; Category: Connectors, Interconnects; Stock 1: 6691; Pricing 1: 1=1.38, 10=1.215, 50=1.0954, 100=1.0478, 250=0.95256, 500=0.85728, 1000=0.76204, 2500=0.6906, 5000=0.66678 (AUD); Packaging: Tray; Contact Type: Male Pin; Number of Rows: 2; Row Spacing: 0.118" (3.00mm); Contact Mating Length: -; Mounting Type: Through Hole; Termination: Press-Fit; Fastening Type: Locking Ramp; Features: Board Guide; Contact Finish: Tin; Contact Finish Thickness: 100µin (2.54µm); Color: Black; ComponentLink1URL: http://www.molex.com/pdm_docs/sd/430450412_sd.pdf; ComponentLink1Description: http://www.molex.com/pdm_docs/sd/430450412_sd.pdf

## Sheet ltc1474_100mA.SchDoc
size A4
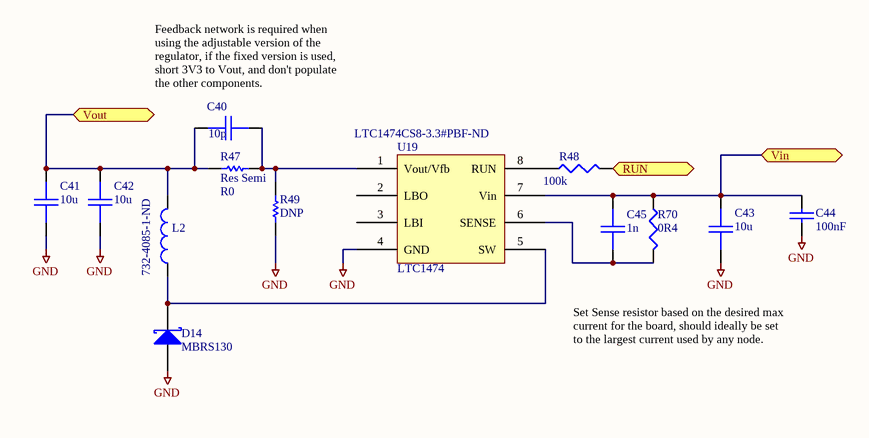
[diagram p10: ltc1474_100mA.SchDoc]

### Parts
C40  10p  [0603]
C41  10u  [1206]
C42  10u  [1206]
C43  10u  [1206]
C44  100nF  [0603]
C45  1n  [0603]
D14  MBRS130  [SMB]
L2  Supplier Part Number 1: 732-4085-1-ND  [WE-TPC-744042331]  (hidden comment: INDUCTOR)
R47  Res Semi  value R0  [0603]
R48  100k  [0603]
R49  DNP  [0603]
R70  0R4  [0603]
U19  LTC1474  Supplier Part Number 1: LTC1474CS8-3.3#PBF-ND  [SO8]

### Ports
RUN, Vin, Vout

### Nets
3V3: C40.1 C41.1 C42.1 L2.2 R47.1 ; port Vout
GND: C41.2 C42.2 C43.2 C44.2 D14.A R49.1 U19.4(GND)
Vin: C43.1 C44.1 C45.1 R48.2 R70.1 U19.7(Vin) ; port Vin, port RUN
NetC40_2: C40.2 R47.2 R49.2 U19.1(Vout/Vfb)
NetC45_2: C45.2 R70.2 U19.6(SENSE)
NetD14_K: D14.K L2.1 U19.5(SW)
NetR48_1: R48.1 U19.8(RUN)

Not connected (* = marked no-connect by the designer): U19 2(LBO) 3(LBI)

### Notes on the sheet
- (near C40) Feedback network is required when using the adjustable version of the regulator, if the fixed version is used, short 3V3 to Vout, and don't populate the other components.
- Set Sense resistor based on the desired max current for the board, should ideally be set to the largest current used by any node.

### Library data of the parts
C40 = CAP: Capacitor; Manufacturer: TDK Corporation; Manufacturer Part Number: C1608C0G1H100D080AA; Value: 1nF; Description: CAP CER 10PF 50V NP0 0603; Capacitance: 10pF; Voltage - Rated: 50V; Tolerance: ±0.5pF; Temperature Coefficient: C0G, NP0; Revision: July-2002: Re-released for DXP Platform.; Farnell: 317-202; Price: 0.15; Supplier 1: Digi-Key; Supplier Part Number 1: 445-1269-1-ND; RoHS: RoHS Compliant; Category: Capacitors; Stock 1: 206915; Pricing 1: 1=0.12, 10=0.043, 100=0.0198, 250=0.01624, 500=0.0139, 1000=0.01082 (AUD); Packaging: Cut Tape (CT); Mounting Type: Surface Mount, MLCC; Operating Temperature: -55°C ~ 125°C; Applications: General Purpose; Ratings: -; Package / Case: 0603 (1608 Metric); Size / Dimension: 0.063" L x 0.031" W (1.60mm x 0.80mm); Height - Seated (Max): -; Thickness (Max): 0.037" (0.95mm); Lead Spacing: -; Features: -; Lead Style: -; ComponentLink1URL: http://product.tdk.com/capacitor/mlcc/en/documents/mlcc_commercial_general_en.pdf; ComponentLink1Description: http://product.tdk.com/capacitor/mlcc/en/documents/mlcc_commercial_general_en.pdf
C41-C43 = CAP: Capacitor; Manufacturer: TDK Corporation; Manufacturer Part Number: C3216X5R1A106M160AB; Description: CAP CER 10UF 10V 20% X5R 1206; Capacitance: 10µF; Voltage - Rated: 10V; Tolerance: ±20%; Temperature Coefficient: X5R; Supplier 1: Digi-Key; Supplier Part Number 1: 445-1387-1-ND; RoHS: RoHS Compliant; Category: Capacitors; Stock 1: 132841; Pricing 1: 1=0.32, 10=0.274, 100=0.137, 250=0.10276, 500=0.09076, 1000=0.0805 (AUD); Packaging: Cut Tape (CT); Mounting Type: Surface Mount, MLCC; Operating Temperature: -55°C ~ 85°C; Applications: General Purpose; Ratings: -; Package / Case: 1206 (3216 Metric); Size / Dimension: 0.126" L x 0.063" W (3.20mm x 1.60mm); Height - Seated (Max): -; Thickness (Max): 0.071" (1.80mm); Lead Spacing: -; Features: -; Lead Style: -; ComponentLink1URL: http://product.tdk.com/capacitor/mlcc/en/documents/mlcc_commercial_general_en.pdf; ComponentLink1Description: http://product.tdk.com/capacitor/mlcc/en/documents/mlcc_commercial_general_en.pdf
C44 = CAP: as C17 on sheet button_io; Value: 100nF; Supplier 1: Digi-Key; Supplier Part Number 1: 445-1311-1-ND; RoHS: RoHS Compliant; Category: Capacitors; Stock 1: 569984; Pricing 1: 1=0.14, 10=0.035, 100=0.0159, 250=0.01296, 500=0.0111, 1000=0.00865 (AUD); Packaging: Cut Tape (CT); Mounting Type: Surface Mount, MLCC; Operating Temperature: -55°C ~ 125°C; Applications: General Purpose; Ratings: -; Package / Case: 0603 (1608 Metric); Size / Dimension: 0.063" L x 0.031" W (1.60mm x 0.80mm); Height - Seated (Max): -; Thickness (Max): 0.037" (0.95mm); Lead Spacing: -; Features: -; Lead Style: -; ComponentLink1URL: http://product.tdk.com/capacitor/mlcc/en/documents/mlcc_commercial_general_en.pdf; ComponentLink1Description: http://product.tdk.com/capacitor/mlcc/en/documents/mlcc_commercial_general_en.pdf
C45 = CAP: Capacitor; Manufacturer: TDK Corporation; Manufacturer Part Number: CGA3E2X7R1H102K080AA; Value: 1nF; Description: CAP CER 1000PF 50V 10% X7R 0603; Capacitance: 1000pF; Voltage - Rated: 50V; Tolerance: ±10%; Temperature Coefficient: X7R; Revision: July-2002: Re-released for DXP Platform.; Farnell: 317-202; Price: 0.15; Supplier 1: Digi-Key; Supplier Part Number 1: 445-5659-1-ND; RoHS: RoHS Compliant; Category: Capacitors; Stock 1: 28744; Pricing 1: 1=0.12, 10=0.043, 100=0.0198, 250=0.01624, 500=0.0139, 1000=0.01082 (AUD); Packaging: Cut Tape (CT); Mounting Type: Surface Mount, MLCC; Operating Temperature: -55°C ~ 125°C; Applications: Automotive; Ratings: AEC-Q200; Package / Case: 0603 (1608 Metric); Size / Dimension: 0.063" L x 0.031" W (1.60mm x 0.80mm); Height - Seated (Max): -; Thickness (Max): 0.035" (0.90mm); Lead Spacing: -; Features: -; Lead Style: -; ComponentLink1URL: http://product.tdk.com/capacitor/mlcc/en/documents/mlcc_automotive_general_en.pdf; ComponentLink1Description: http://product.tdk.com/capacitor/mlcc/en/documents/mlcc_automotive_general_en.pdf
D14 = D SCHOTTKY: Schottky Diode; Manufacturer: Fairchild Semiconductor; Manufacturer Part Number: MBRS130L; Description: DIODE SCHOTTKY 30V 2A DO214AA; Voltage - DC Reverse (Vr) (Max): 30V; Current - Average Rectified (Io): 2A; Voltage - Forward (Vf) (Max) @ If: 445mV @ 2A; Speed: Fast Recovery =< 500ns, > 200mA (Io); Current - Reverse Leakage @ Vr: 1mA @ 30V; Revision: July-2002: Re-released for DXP Platform.; Farnell: 708-150; Price: 1.49; Supplier 1: Digi-Key; Supplier Part Number 1: MBRS130LFSCT-ND; RoHS: RoHS Compliant; Category: Discrete Semiconductor Products; Stock 1: 14124; Pricing 1: 1=0.54, 10=0.428, 25=0.3612, 100=0.2942, 250=0.24364, 500=0.20126, 1000=0.15074 (AUD); Packaging: Cut Tape (CT); Diode Type: Schottky; Reverse Recovery Time (trr): -; Capacitance @ Vr, F: -; Mounting Type: Surface Mount; Package / Case: DO-214AA, SMB; Supplier Device Package: DO-214AA (SMB); ComponentLink1URL: http://www.fairchildsemi.com/ds/MB/MBRS130L.pdf; ComponentLink1Description: http://www.fairchildsemi.com/ds/MB/MBRS130L.pdf
L2 = INDUCTOR: Manufacturer: Wurth Electronics Inc; Manufacturer Part Number: 744042331; Description: INDUCTOR POWER 330UH 150MA SMD; Type: Ferrite Core; Inductance: 330µH; Current Rating: 150mA; Current - Saturation: 130mA; Tolerance: ±30%; Material - Core: Ferrite; Shielding: Shielded; DC Resistance (DCR): 4.5 Ohm Max; Frequency - Self Resonant: 5.5MHz; Frequency - Test: 100kHz; Supplier 1: Digi-Key; RoHS: RoHS Compliant; Category: Inductors, Coils, Chokes; Stock 1: 1473; Pricing 1: 1=3.47, 10=3.239, 25=3.0072, 50=2.6374, 100=2.406, 250=2.1284 (AUD); Packaging: Cut Tape (CT); Q @ Freq: -; Operating Temperature: -40°C ~ 125°C; Package / Case: 1919 (4848 Metric); Size / Dimension: 0.189" L x 0.189" W x 0.071" H (4.80mm x 4.80mm x 1.80mm); Mounting Type: Surface Mount; ComponentLink1URL: http://katalog.we-online.de/pbs/datasheet/744042331.pdf; ComponentLink1Description: http://katalog.we-online.de/pbs/datasheet/744042331.pdf
R47 = Res Semi: Semiconductor Resistor; Manufacturer: Panasonic Electronic Components; Manufacturer Part Number: ERJ-3GEY0R00V; Description: RES 0.0 OHM 1/10W JUMP 0603 SMD; Resistance (Ohms): 0.0; Power (Watts): 0.1W, 1/10W; Tolerance: Jumper; Published: 8-Jun-2000; LatestRevisionDate: 17-Jul-2002; LatestRevisionNote: Re-released for DXP Platform.; PackageReference: AXIAL-0.5; Publisher: Altium Limited; PackageDescription: Axial Device, Thru-Hole; 2 Leads; 0.5 in Pin Spacing; Supplier 1: Digi-Key; Supplier Part Number 1: P0.0GCT-ND; RoHS: RoHS Compliant; Category: Resistors; Stock 1: 8823198; Pricing 1: 1=0.02, 50=0.011, 100=0.0084, 250=0.00624, 500=0.00462, 1000=0.00308 (AUD); Packaging: Cut Tape (CT); Composition: Thick Film; Features: -; Temperature Coefficient: -; Package / Case: 0603 (1608 Metric); Supplier Device Package: 0603; Size / Dimension: 0.063" L x 0.031" W (1.60mm x 0.80mm); Height: 0.022" (0.55mm); Number of Terminations: 2; ComponentLink1URL: http://industrial.panasonic.com/www-cgi/jvcr13pz.cgi?E+PZ+3+AOA0001+ERJ3GEY0R00V+7+WW; ComponentLink1Description: http://industrial.panasonic.com/www-cgi/jvcr13pz.cgi?E+PZ+3+AOA0001+ERJ3GEY0R00V+7+WW
R48 = RES1: Resistor; Manufacturer: Panasonic Electronic Components; Manufacturer Part Number: ERJ-3GEYJ104V; Description: RES 100K OHM 1/10W 5% 0603 SMD; Power (Watts): 0.1W, 1/10W; Temperature Coefficient: ±200ppm/°C; Tolerance: ±5%; Value: 100k; Farnell: 612-728; Price: 0.13; Supplier 1: Digi-Key; Supplier Part Number 1: P100KGCT-ND; RoHS: RoHS Compliant; Category: Resistors; Stock 1: 1297208; Pricing 1: 1=0.12, 50=0.011, 100=0.0084, 250=0.00624, 500=0.00462, 1000=0.00308 (AUD); Packaging: Cut Tape (CT); Resistance (Ohms): 100k; Composition: Thick Film; Features: -; Package / Case: 0603 (1608 Metric); Supplier Device Package: 0603; Size / Dimension: 0.063" L x 0.031" W (1.60mm x 0.80mm); Height: 0.022" (0.55mm); Number of Terminations: 2; ComponentLink1URL: http://industrial.panasonic.com/www-cgi/jvcr13pz.cgi?E+PZ+3+AOA0001+ERJ3GEYJ104V+7+WW; ComponentLink1Description: http://industrial.panasonic.com/www-cgi/jvcr13pz.cgi?E+PZ+3+AOA0001+ERJ3GEYJ104V+7+WW
R49 = Res Semi: Semiconductor Resistor; Value: R0; Published: 8-Jun-2000; LatestRevisionDate: 17-Jul-2002; LatestRevisionNote: Re-released for DXP Platform.; PackageReference: AXIAL-0.5; Publisher: Altium Limited; PackageDescription: Axial Device, Thru-Hole; 2 Leads; 0.5 in Pin Spacing
R70 = RES1: Resistor; Manufacturer: Yageo; Manufacturer Part Number: RL0603FR-070R4L; Value: 1.2R; Description: RES 0.4 OHM 1/10W 1% 0603 SMD; Resistance (Ohms): 0.4; Power (Watts): 0.1W, 1/10W; Temperature Coefficient: ±800ppm/°C; Tolerance: ±1%; Revision: July-2002: Re-released for DXP Platform.; Farnell: 360-2229; Price: 0.15; Supplier 1: Digi-Key; Supplier Part Number 1: 311-.4QCT-ND; RoHS: RoHS Compliant; Category: Resistors; Stock 1: 9678; Pricing 1: 1=0.49, 10=0.38, 25=0.2888, 100=0.1596, 250=0.13484, 500=0.11556, 1000=0.08806, 2500=0.08255 (AUD); Packaging: Cut Tape (CT); Composition: Thick Film; Features: Current Sense; Package / Case: 0603 (1608 Metric); Supplier Device Package: 0603; Size / Dimension: 0.063" L x 0.031" W (1.60mm x 0.80mm); Height: 0.022" (0.55mm); Number of Terminations: 2; ComponentLink1URL: http://www.yageo.com/documents/recent/PYu_RL_521_RoHS_L_v6.pdf; ComponentLink1Description: http://www.yageo.com/documents/recent/PYu_RL_521_RoHS_L_v6.pdf
U19 = LTC1474: Step-down converter; Manufacturer: Linear Technology; Manufacturer Part Number: LTC1474CS8-3.3#PBF; Description: IC REG BUCK 3.3V 0.75A 8SOIC; Output Type: Fixed; Number of Outputs: 1; Voltage - Output: 3.3V; Voltage - Input: 3 V ~ 18 V; PWM Type: Burst Mode®; Current - Output: 750mA; Synchronous Rectifier: No; Farnell: NA; Supplier 1: Digi-Key; RoHS: RoHS Compliant; Category: Integrated Circuits (ICs); Stock 1: 1575; Pricing 1: 1=8.3, 25=5.514, 100=4.3866 (AUD); Packaging: Tube; Type: Step-Down (Buck); Frequency - Switching: -; Operating Temperature: 0°C ~ 70°C; Mounting Type: Surface Mount; Package / Case: 8-SOIC (0.154", 3.90mm Width); Supplier Device Package: 8-SOIC; ComponentLink1URL: http://www.linear.com/docs/1377; ComponentLink1Description: http://www.linear.com/docs/1377